# Altium schematic sheet v2.0.SchDoc
size 208 x 76 mm
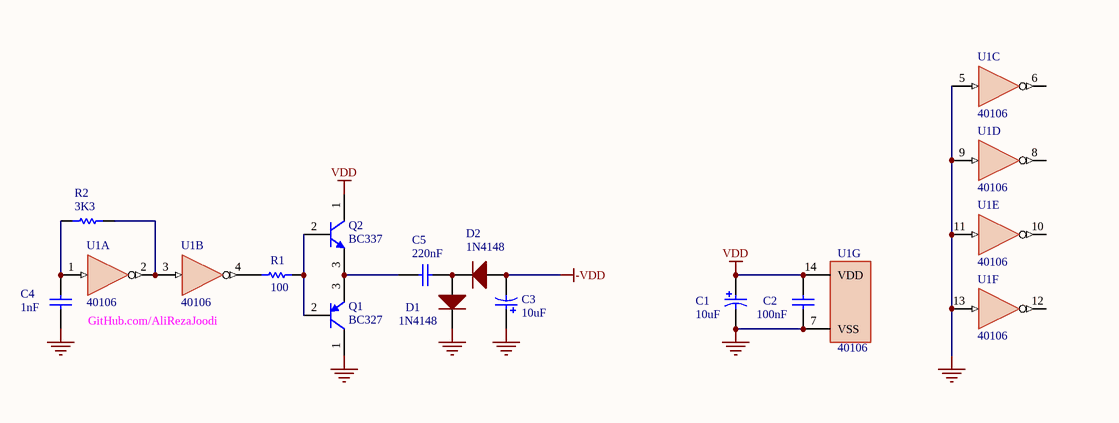
[diagram p0: v2.0.SchDoc]

## Parts
C1  10uF  [THD_P2.54/D6/H11]
C2  100nF  [THD_P2.54/D5/T2]
C3  10uF  [THD_P2.54/D6/H11]
C4  1nF  [THD_P2.54/D5/T2]
C5  220nF  [THD_P5.08/D4.2/T2]
D1  1N4148  [THD_AXIAL0.3_DO-35]
D2  1N4148  [THD_AXIAL0.3_DO-35]
Q1  BC327  [TO92_3Pin]
Q2  BC337  [TO92_3Pin]
R1  100  [THD_AXIAL0.4]
R2  3K3  [THD_AXIAL0.4_VER]
U1  40106  [DIP_14]  (parts A,B,C,D,E,F,G of 7)

## Nets
-VDD: C3.2 D2.1(A)
GND: C1.2 C2.1 C3.1 C4.1 D1.2(K) Q1.1(C) U1.5(I) U1.7(VSS) U1.9(I) U1.11(I) U1.13(I)
VDD: C1.1 C2.2 Q2.1(C) U1.14(VDD)
NetC4_2: C4.2 R2.2 U1.1(I)
NetC5_1: C5.1 D1.1(A) D2.2(K)
NetC5_2: C5.2 Q1.3(E) Q2.3(E)
NetQ1_2: Q1.2(B) Q2.2(B) R1.1
NetR1_2: R1.2 U1.4(~{O})
NetR2_1: R2.1 U1.2(~{O}) U1.3(I)

Not connected (* = marked no-connect by the designer): U1 6(~{O}) 8(~{O}) 10(~{O}) 12(~{O})

## Notes on the sheet
- GitHub.com/AliRezaJoodi

## Library data of the parts
C1 C3 = Capacitor_Electrolytic: Capacitor, Electrolytic, 25V, 20%; 1_Manufacturer: KEMET; 1_Part Number: ESK227M025AG3EA; 1_Link: https://eu.mouser.com/ProductDetail/KEMET/ESK227M025AG3EA?qs=w9hhVRgtvflpdyQRt9STXA%3D%3D
C2 C4 C5 = Capacitor_Ceramic: Capacitor, Ceramic Multilayer, 25V, 10%
D1 D2 = Diode_2Form: Diode; 1_Manufacturer: Microchip Technology; 1_Part Number: 1N4148UR-1; 1_Link: https://eu.mouser.com/ProductDetail/Microchip-Technology/1N4148UR-1?qs=%252BRKXB2WKlSdXiNZTe6I9fg%3D%3D
Q1 = BC327: Transistor, BJT, PNP; Package Reference: TO-92A
Q2 = BC337: Transistor, BJT, NPN; Package Reference: TO-92A
R1 R2 = Resistor: Resistor, 1/4W, 5%; Revision: July-2002: Re-released for DXP Platform.
U1 = 40106: Hex inverting Schmitt trigger; 1_Manufacturer: Texas Instruments; 1_Part Number: CD40106BM96; 1_Link: https://eu.mouser.com/ProductDetail/Texas-Instruments/CD40106BM96?qs=JHHQeKcAU3BBPrs16F1q0Q%3D%3D